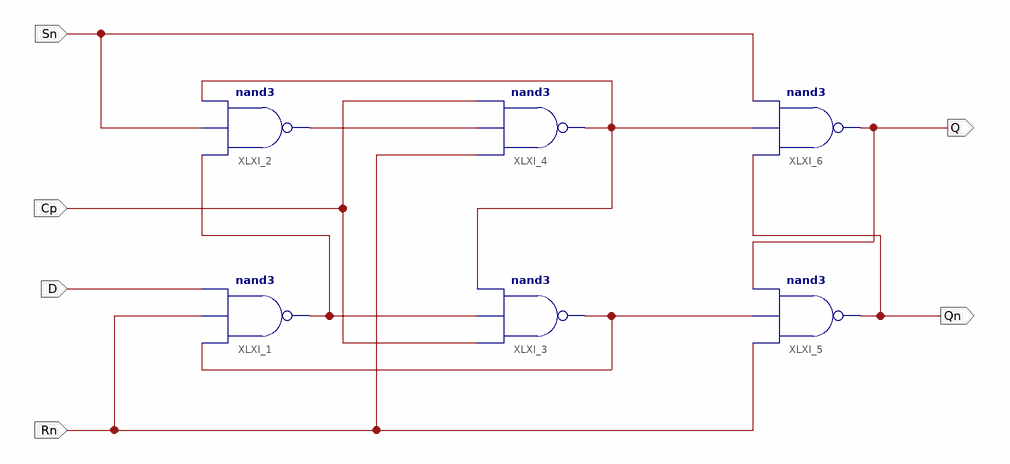
[diagram p0: schematic sheet 1]
// Xilinx ISE schematic MB_DFF.sch (kintex7) as structural Verilog: 6 symbols, 6 ports
module MB_DFF (
  input  D,
  input  Rn,
  input  Sn,
  input  Cp,
  output Qn,
  output Q
);

  wire XLXN_7, XLXN_18, XLXN_21, XLXN_25;

  nand XLXI_1 (XLXN_25, XLXN_7, Rn, D);
  nand XLXI_2 (XLXN_21, XLXN_25, Sn, XLXN_18);
  nand XLXI_3 (XLXN_7, Cp, XLXN_25, XLXN_18);
  nand XLXI_4 (XLXN_18, Rn, XLXN_21, Cp);
  nand XLXI_5 (Qn, Rn, XLXN_7, Q);
  nand XLXI_6 (Q, Qn, XLXN_18, Sn);
endmodule
